# Altium schematic sheet TopLevel.SchDoc: C2Sv1 Top Level
size A4; Author: Felix Abbott; SheetNumber: 1; SheetTotal: 5; Time: CubeSat Camera System
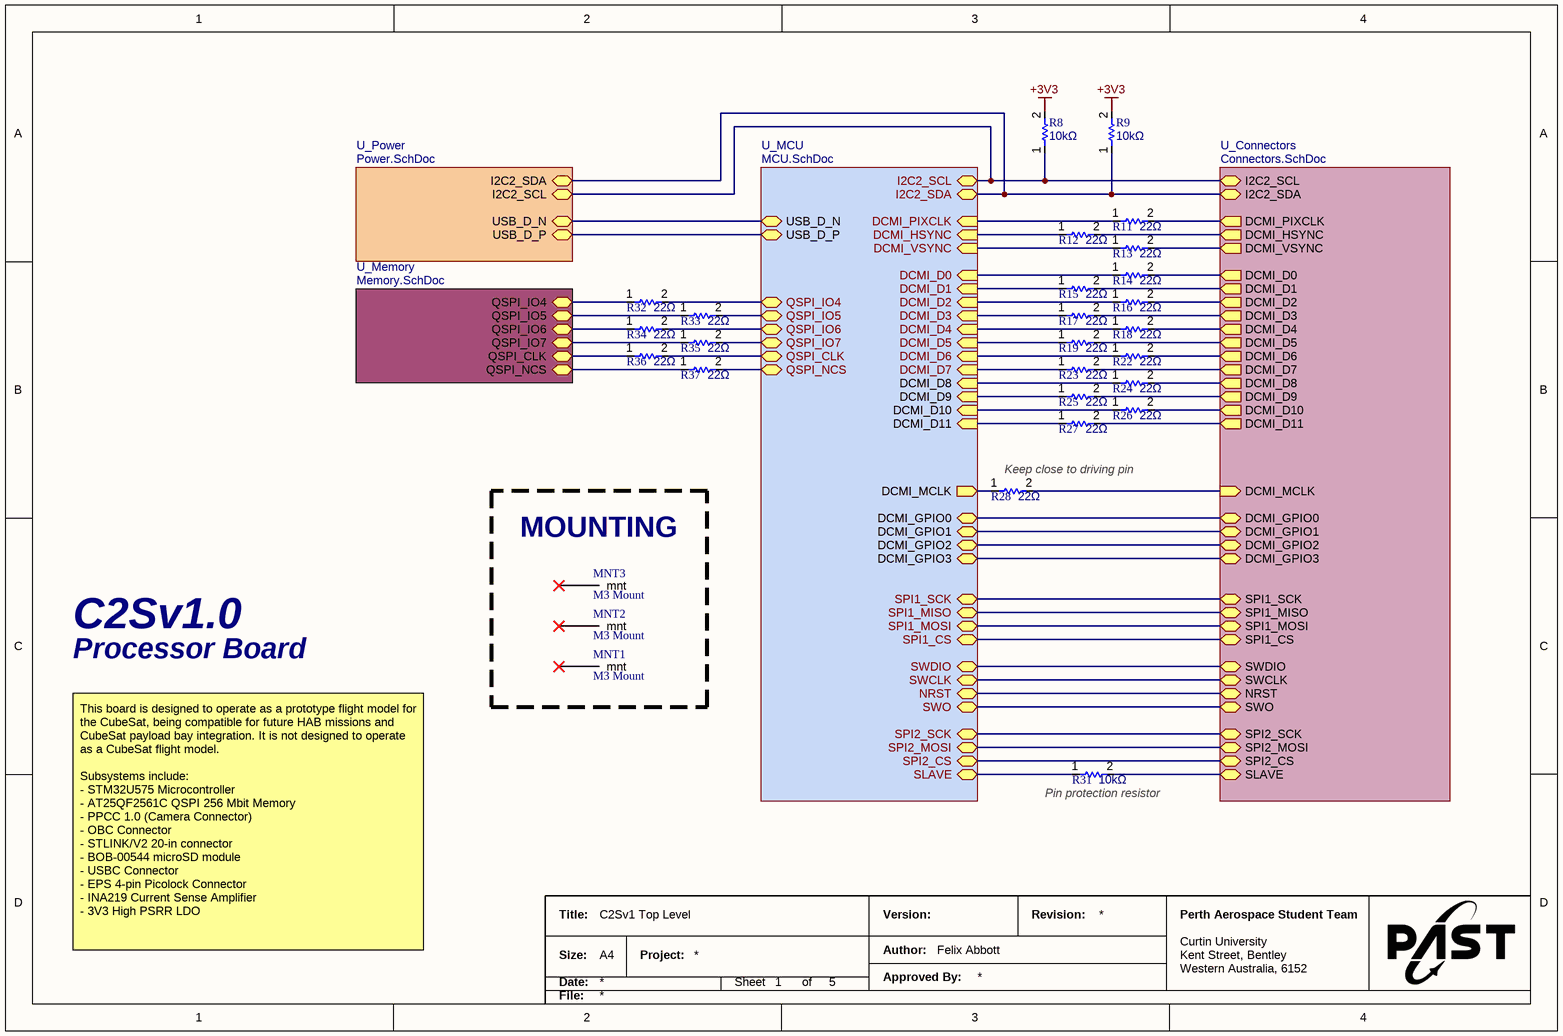
[diagram p0: TopLevel.SchDoc]

## Parts
MNT1  M3 Mount  [M3_Mount-Footprint-1]
MNT2  M3 Mount  [M3_Mount-Footprint-1]
MNT3  M3 Mount  [M3_Mount-Footprint-1]
R8  value 10kΩ  [FP-CRCW0603-e3-IPC_C]  (hidden comment: CRCW060310K0FKED)
R9  value 10kΩ  [FP-CRCW0603-e3-IPC_C]  (hidden comment: CRCW060310K0FKED)
R11  value 22Ω  [FP-CRCW0402-e3-IPC_A]  (hidden comment: CRCW040222R0JNED)
R12  value 22Ω  [FP-CRCW0402-e3-IPC_A]  (hidden comment: CRCW040222R0JNED)
R13  value 22Ω  [FP-CRCW0402-e3-IPC_A]  (hidden comment: CRCW040222R0JNED)
R14  value 22Ω  [FP-CRCW0402-e3-IPC_A]  (hidden comment: CRCW040222R0JNED)
R15  value 22Ω  [FP-CRCW0402-e3-IPC_A]  (hidden comment: CRCW040222R0JNED)
R16  value 22Ω  [FP-CRCW0402-e3-IPC_A]  (hidden comment: CRCW040222R0JNED)
R17  value 22Ω  [FP-CRCW0402-e3-IPC_A]  (hidden comment: CRCW040222R0JNED)
R18  value 22Ω  [FP-CRCW0402-e3-IPC_A]  (hidden comment: CRCW040222R0JNED)
R19  value 22Ω  [FP-CRCW0402-e3-IPC_A]  (hidden comment: CRCW040222R0JNED)
R22  value 22Ω  [FP-CRCW0402-e3-IPC_A]  (hidden comment: CRCW040222R0JNED)
R23  value 22Ω  [FP-CRCW0402-e3-IPC_A]  (hidden comment: CRCW040222R0JNED)
R24  value 22Ω  [FP-CRCW0402-e3-IPC_A]  (hidden comment: CRCW040222R0JNED)
R25  value 22Ω  [FP-CRCW0402-e3-IPC_A]  (hidden comment: CRCW040222R0JNED)
R26  value 22Ω  [FP-CRCW0402-e3-IPC_A]  (hidden comment: CRCW040222R0JNED)
R27  value 22Ω  [FP-CRCW0402-e3-IPC_A]  (hidden comment: CRCW040222R0JNED)
R28  value 22Ω  [FP-CRCW0402-e3-IPC_A]  (hidden comment: CRCW040222R0JNED)
R31  value 10kΩ  [FP-CRCW0603-e3-IPC_C]  (hidden comment: CRCW060310K0FKED)
R32  value 22Ω  [FP-CRCW0402-e3-IPC_A]  (hidden comment: CRCW040222R0JNED)
R33  value 22Ω  [FP-CRCW0402-e3-IPC_A]  (hidden comment: CRCW040222R0JNED)
R34  value 22Ω  [FP-CRCW0402-e3-IPC_A]  (hidden comment: CRCW040222R0JNED)
R35  value 22Ω  [FP-CRCW0402-e3-IPC_A]  (hidden comment: CRCW040222R0JNED)
R36  value 22Ω  [FP-CRCW0402-e3-IPC_A]  (hidden comment: CRCW040222R0JNED)
R37  value 22Ω  [FP-CRCW0402-e3-IPC_A]  (hidden comment: CRCW040222R0JNED)

## Blocks framed on the sheet
MOUNTING: MNT1-MNT3

## Sub-sheets
U_Connectors = Connectors.SchDoc: DCMI_D7 (out), DCMI_D6 (out), DCMI_D5 (out), DCMI_D4 (out), DCMI_D3 (out), DCMI_D2 (out), DCMI_D0 (out), DCMI_D1 (out), DCMI_PIXCLK (out), DCMI_HSYNC (out), DCMI_VSYNC (out), DCMI_D8 (out), DCMI_D9 (out), DCMI_D10 (out), DCMI_D11 (out), DCMI_MCLK (in), DCMI_GPIO0 (bidir), DCMI_GPIO1 (bidir), DCMI_GPIO2 (bidir), DCMI_GPIO3 (bidir), SPI1_SCK (bidir), SPI1_MISO (bidir), SPI1_MOSI (bidir), SPI1_CS (bidir), SWDIO (bidir), SWCLK (bidir), NRST (bidir), SWO (bidir), SPI2_SCK (bidir), SPI2_MOSI (bidir), SPI2_CS (bidir), SLAVE (bidir), I2C2_SCL (bidir), I2C2_SDA (bidir)
U_MCU = MCU.SchDoc: DCMI_PIXCLK (in), DCMI_VSYNC (in), DCMI_HSYNC (in), DCMI_D7 (in), DCMI_D6 (in), DCMI_D5 (in), DCMI_D4 (in), DCMI_D3 (in), DCMI_D2 (in), DCMI_D1 (in), DCMI_D0 (in), DCMI_D8 (in), DCMI_D9 (in), DCMI_D11 (in), DCMI_D10 (in), DCMI_MCLK (out), DCMI_GPIO0 (bidir), DCMI_GPIO2 (bidir), DCMI_GPIO1 (bidir), DCMI_GPIO3 (bidir), NRST (bidir), SWO (bidir), SWCLK (bidir), SWDIO (bidir), SPI1_MOSI (bidir), SPI1_MISO (bidir), SPI1_CS (bidir), SLAVE (bidir), SPI1_SCK (bidir), SPI2_SCK (bidir), SPI2_CS (bidir), SPI2_MOSI (bidir), I2C2_SCL (bidir), I2C2_SDA (bidir), QSPI_IO7 (bidir), QSPI_IO6 (bidir), QSPI_IO5 (bidir), QSPI_IO4 (bidir), QSPI_CLK (bidir), QSPI_NCS (bidir), USB_D_N (bidir), USB_D_P (bidir)
U_Memory = Memory.SchDoc: QSPI_IO4 (bidir), QSPI_IO5 (bidir), QSPI_IO6 (bidir), QSPI_IO7 (bidir), QSPI_CLK (bidir), QSPI_NCS (bidir)
U_Power = Power.SchDoc: USB_D_N (bidir), USB_D_P (bidir), I2C2_SDA (bidir), I2C2_SCL (bidir)

## Nets
+3V3: R8.2 R9.2
NetR8_1: R8.1 ; sheet U_Connectors/I2C2_SCL, sheet U_Power/I2C2_SCL, sheet U_MCU/I2C2_SCL
NetR9_1: R9.1 ; sheet U_Connectors/I2C2_SDA, sheet U_Power/I2C2_SDA, sheet U_MCU/I2C2_SDA
NetR11_1: R11.1 ; sheet U_MCU/DCMI_PIXCLK
NetR11_2: R11.2 ; sheet U_Connectors/DCMI_PIXCLK
NetR12_1: R12.1 ; sheet U_MCU/DCMI_HSYNC
NetR12_2: R12.2 ; sheet U_Connectors/DCMI_HSYNC
NetR13_1: R13.1 ; sheet U_MCU/DCMI_VSYNC
NetR13_2: R13.2 ; sheet U_Connectors/DCMI_VSYNC
NetR14_1: R14.1 ; sheet U_MCU/DCMI_D0
NetR14_2: R14.2 ; sheet U_Connectors/DCMI_D0
NetR15_1: R15.1 ; sheet U_MCU/DCMI_D1
NetR15_2: R15.2 ; sheet U_Connectors/DCMI_D1
NetR16_1: R16.1 ; sheet U_MCU/DCMI_D2
NetR16_2: R16.2 ; sheet U_Connectors/DCMI_D2
NetR17_1: R17.1 ; sheet U_MCU/DCMI_D3
NetR17_2: R17.2 ; sheet U_Connectors/DCMI_D3
NetR18_1: R18.1 ; sheet U_MCU/DCMI_D4
NetR18_2: R18.2 ; sheet U_Connectors/DCMI_D4
NetR19_1: R19.1 ; sheet U_MCU/DCMI_D5
NetR19_2: R19.2 ; sheet U_Connectors/DCMI_D5
NetR22_1: R22.1 ; sheet U_MCU/DCMI_D6
NetR22_2: R22.2 ; sheet U_Connectors/DCMI_D6
NetR23_1: R23.1 ; sheet U_MCU/DCMI_D7
NetR23_2: R23.2 ; sheet U_Connectors/DCMI_D7
NetR24_1: R24.1 ; sheet U_MCU/DCMI_D8
NetR24_2: R24.2 ; sheet U_Connectors/DCMI_D8
NetR25_1: R25.1 ; sheet U_MCU/DCMI_D9
NetR25_2: R25.2 ; sheet U_Connectors/DCMI_D9
NetR26_1: R26.1 ; sheet U_MCU/DCMI_D10
NetR26_2: R26.2 ; sheet U_Connectors/DCMI_D10
NetR27_1: R27.1 ; sheet U_MCU/DCMI_D11
NetR27_2: R27.2 ; sheet U_Connectors/DCMI_D11
NetR28_1: R28.1 ; sheet U_MCU/DCMI_MCLK
NetR28_2: R28.2 ; sheet U_Connectors/DCMI_MCLK
NetR31_1: R31.1 ; sheet U_MCU/SLAVE
NetR31_2: R31.2 ; sheet U_Connectors/SLAVE
NetR32_1: R32.1 ; sheet U_Memory/QSPI_IO4
NetR32_2: R32.2 ; sheet U_MCU/QSPI_IO4
NetR33_1: R33.1 ; sheet U_Memory/QSPI_IO5
NetR33_2: R33.2 ; sheet U_MCU/QSPI_IO5
NetR34_1: R34.1 ; sheet U_Memory/QSPI_IO6
NetR34_2: R34.2 ; sheet U_MCU/QSPI_IO6
NetR35_1: R35.1 ; sheet U_Memory/QSPI_IO7
NetR35_2: R35.2 ; sheet U_MCU/QSPI_IO7
NetR36_1: R36.1 ; sheet U_Memory/QSPI_CLK
NetR36_2: R36.2 ; sheet U_MCU/QSPI_CLK
NetR37_1: R37.1 ; sheet U_Memory/QSPI_NCS
NetR37_2: R37.2 ; sheet U_MCU/QSPI_NCS
(unnamed): sheet U_Connectors/DCMI_GPIO0, sheet U_MCU/DCMI_GPIO0
(unnamed): sheet U_Connectors/DCMI_GPIO1, sheet U_MCU/DCMI_GPIO1
(unnamed): sheet U_Connectors/DCMI_GPIO2, sheet U_MCU/DCMI_GPIO2
(unnamed): sheet U_Connectors/DCMI_GPIO3, sheet U_MCU/DCMI_GPIO3
(unnamed): sheet U_Connectors/SPI1_SCK, sheet U_MCU/SPI1_SCK
(unnamed): sheet U_Connectors/SPI1_MISO, sheet U_MCU/SPI1_MISO
(unnamed): sheet U_Connectors/SPI1_MOSI, sheet U_MCU/SPI1_MOSI
(unnamed): sheet U_Connectors/SPI1_CS, sheet U_MCU/SPI1_CS
(unnamed): sheet U_Connectors/SWDIO, sheet U_MCU/SWDIO
(unnamed): sheet U_Connectors/SWCLK, sheet U_MCU/SWCLK
(unnamed): sheet U_Connectors/NRST, sheet U_MCU/NRST
(unnamed): sheet U_Connectors/SWO, sheet U_MCU/SWO
(unnamed): sheet U_Connectors/SPI2_SCK, sheet U_MCU/SPI2_SCK
(unnamed): sheet U_Connectors/SPI2_MOSI, sheet U_MCU/SPI2_MOSI
(unnamed): sheet U_Connectors/SPI2_CS, sheet U_MCU/SPI2_CS
(unnamed): sheet U_Power/USB_D_N, sheet U_MCU/USB_D_N
(unnamed): sheet U_Power/USB_D_P, sheet U_MCU/USB_D_P

Not connected (* = marked no-connect by the designer): MNT1 1(mnt)*; MNT2 1(mnt)*; MNT3 1(mnt)*

## Notes on the sheet
- (near R28) Keep close to driving pin
- C2Sv1.0
- Processor Board
- (near R31) Pin protection resistor
- This board is designed to operate as a prototype flight model for the CubeSat, being compatible for future HAB missions and CubeSat payload bay integration. It is not designed to operate as a CubeSat flight model.
  Subsystems include:
  - STM32U575 Microcontroller
  - AT25QF2561C QSPI 256 Mbit Memory
  - PPCC 1.0 (Camera Connector)
  - OBC Connector
  - STLINK/V2 20-in connector
  - BOB-00544 microSD module
  - USBC Connector
  - EPS 4-pin Picolock Connector
  - INA219 Current Sense Amplifier
  - 3V3 High PSRR LDO
- Title:
- Version:
- Revision:
- Perth Aerospace Student Team
- Size:
- Date:
- A4
- Project:
- Sheet
- of
- Author:
- Approved By:
- Curtin University
- Kent Street, Bentley
- Western Australia, 6152
- File:

## Library data of the parts
MNT1-MNT3 = CMP-002-00124-2: M3 mounting hole; Author: Raphael Ho
R8 R9 R31 = CMP-009-00205-3: Resistor; Temperature Coefficient: 100ppm/°C; Working Voltage: 75V; Power Dissipation: 100mW; Added By: Felix; Tolerance: 1%; Max Operating Temperature: 155°C; Width: 850µm; Composition: Thick Film; Mounting Technology: Surface Mount; Number of Terminations: 2; Height: 450µm; Number of Terminals: 2; RoHS: Compliant; Power Rating: 100mW; Harmonized Tariff Schedule (HTS) Code: 8533.21.00.30; Case/Package: 0603; Export Control Classification Number (ECCN) Code: EAR99; Introduction Date: 2003-05-01; REACH SVHC: Yes; Lead Free: Lead Free; Features: Automotive AEC-Q200; Min Operating Temperature: -55°C; Voltage Rating: 75V; Country of Origin: Israel, Taiwan; Lifecycle Status: Production; Max Power Dissipation: 100mW; Length: 1.55mm; Packaging: Tape & Reel (TR); China RoHS: Non-Compliant
R11-R19 R22-R28 R32-R37 = CMP-009-00208-3: Resistor; Max Power Dissipation: 63mW; Tolerance: 5%; Added By: Felix Abbott; Working Voltage: 50V; Temperature Coefficient: 200ppm/°C; Lifecycle Status: Production; Case/Package: 0402; RoHS: Compliant; Features: Automotive AEC-Q200; Width: 500µm; REACH SVHC: Yes; Schedule B: 8533210045, 8533210045; Lead Free: Lead Free; Min Operating Temperature: -55°C; Pins: 2; Number of Terminations: 2; Export Control Classification Number (ECCN) Code: EAR99; Introduction Date: 2005-03-24; Ratings: AEC-Q200; Length: 1mm; Military Standard: Not; Power Rating: 63mW; Weight: 652.039032µg; Height: 350µm; Mounting Technology: Surface Mount; Termination: SMD/SMT; Composition: Thick Film; China RoHS: Non-Compliant; Max Operating Temperature: 155°C; Depth: 500µm; Country of Origin: Israel, Taiwan; Voltage Rating (DC): 50V; Packaging: Cut Tape; Contact Plating: Tin; Case Code (Imperial): 0402; Voltage Rating: 50V; Number of Terminals: 2; Harmonized Tariff Schedule (HTS) Code: 8533.21.00.30